# Altium schematic sheet Sensors.SchDoc
size A; SheetNumber: 4; SheetTotal: 7
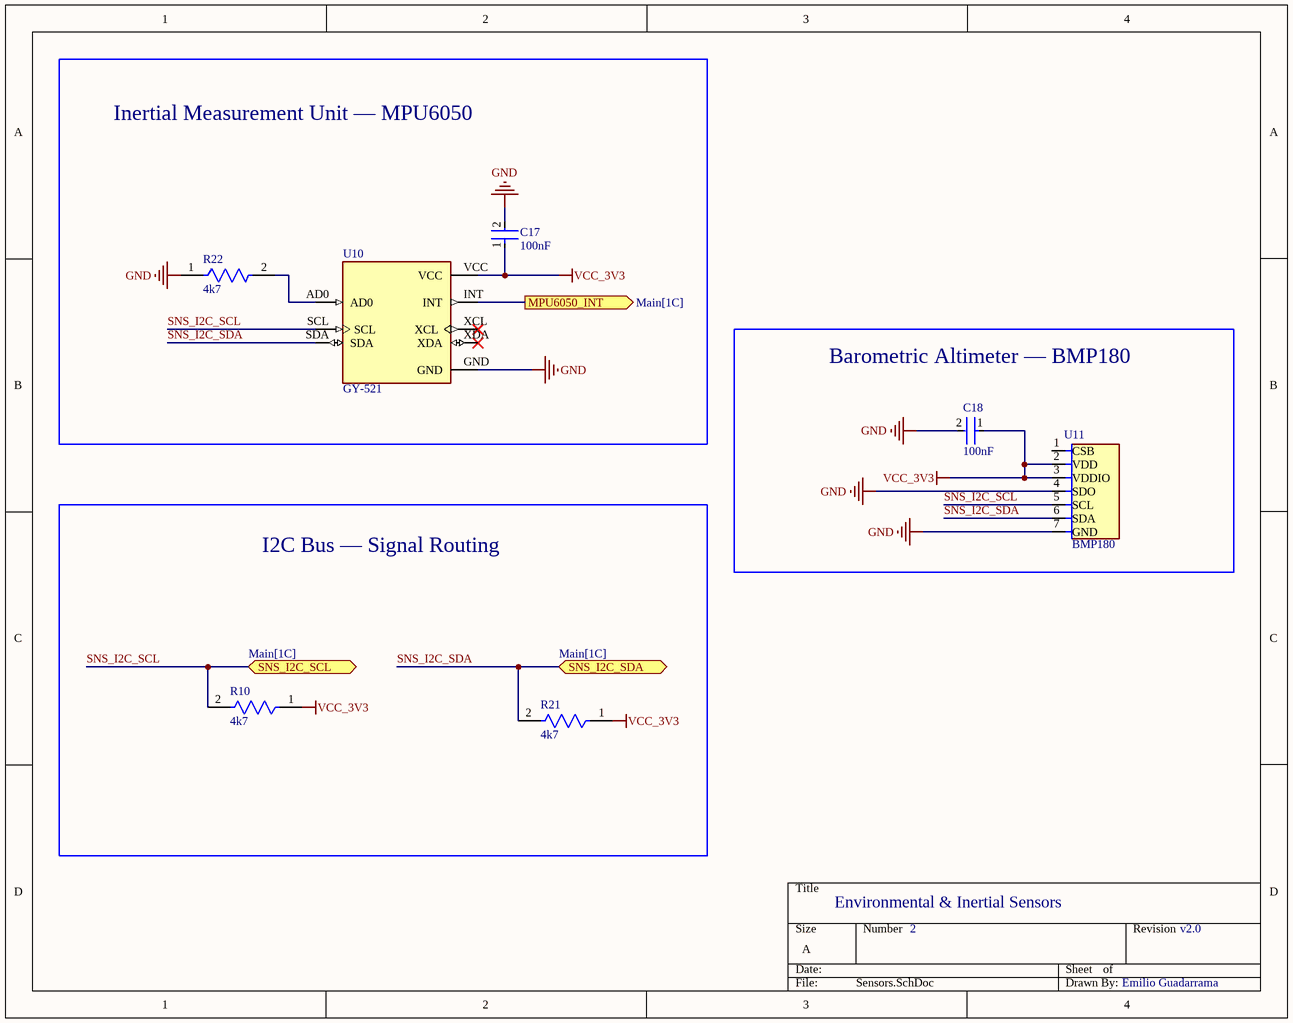
[diagram p0: Sensors.SchDoc]

## Parts
C17  100nF  [FP-C0805C-DN-MFG]
C18  100nF  [FP-C0805C-DN-MFG]
R10  4k7  [FP-MCT0603-IPC_A]
R21  4k7  [FP-MCT0603-IPC_A]
R22  4k7  [FP-MCT0603-IPC_A]
U10  GY-521  [MODULE_GY-521]
U11  BMP180  [LGA7-1.5-3.8X3.6MM]

## Blocks framed on the sheet
Inertial Measurement Unit — MPU6050: C17 R22 U10
I2C Bus — Signal Routing: R10 R21

## Ports
MPU6050_INT (out, see Main[1C]), SNS_I2C_SCL (bidir, see Main[1C]), SNS_I2C_SDA (bidir, see Main[1C])

## Nets
GND: C17.2 C18.2 R22.1 U10.GND U11.4(SDO) U11.7(GND)
VCC_3V3: C17.1 C18.1 R10.1 R21.1 U10.VCC U11.2(VDD) U11.3(VDDIO)
MPU6050_INT: U10.INT ; port MPU6050_INT
SNS_I2C_SCL: R10.2 U10.SCL U11.5(SCL) ; port SNS_I2C_SCL
SNS_I2C_SDA: R21.2 U10.SDA U11.6(SDA) ; port SNS_I2C_SDA
NetR22_2: R22.2 U10.AD0

Not connected (* = marked no-connect by the designer): U10 XCL* XDA*; U11 1(CSB)

## Notes on the sheet
- Barometric Altimeter — BMP180
- Environmental & Inertial Sensors
- 2
- v2.0
- Emilio Guadarrama

## Library data of the parts
C17 C18 = CMP-2007-00279-2: CAP CER 0.1UF 50V X7R 0805; Manufacturer Part Number: C0805C104K5RACTU; Manufacturer: KEMET; Value: 0.10 μF; Tolerance: 0.1; Temperature Coefficient: 30ppm/°C; Material: Ceramic; Device Class L2: Capacitors; Temperature Range Low: -55°C; Voltage Rating: 50 V; Digikey Description: CAP CER 0.1UF 50V X7R 0805; Category: Cap; ComponentLink2Description: Datasheet; Octopart: https://octopart.com/c0805c104k5ractu-kemet-143926; RoHS: TRUE; ComponentLink2URL: https://content.kemet.com/datasheets/KEM_C1003_C0G_SMD.pdf; Temperature Characteristic: X7R; Temperature: -55°C to +125°C; Height: 0.88mm; Temperature Range High: +125°C; Device Class L1: Passive Components; Automotive: No; Lead Free: Yes; Ipc Land Pattern Name: CAPC200125X78; Device Class L3: Ceramic Capacitors; Mouser Description: Cap Ceramic 0.1uF 50V X7R 10% SMD 2.0 x 1.2 mm 125 C Paper T/R; Capacitance: 0.10 μF; Package: C0805C-DN
R10 R21 R22 = CMP-02407-011165-1: RES SMD 100 OHM 1% 1/8W 0603; Temperature Coefficient: 25ppm/°C; Resistance: 20kR; Power Rating: 125mW; Tolerance: 0.1%; Voltage Rating: 75V; Length: 1.55mm; Case Code (Imperial): 0603; Case/Package: 0603; Construction: Rectangular; Package Quantity: 1000; Number of Terminations: 2; Termination: SMD/SMT; Resistor Type: Thin Film; Features: Automotive AEC-Q200; Series: MCT 0603 - Precision; Max Operating Temperature: 155°C; Depth: 0.85mm; Max Power Dissipation: 125mW; Min Operating Temperature: -55°C; Width: 0.033inch; Case Code (Metric): 1608; Packaging: Tape and Reel; Weight: 6.7E-05oz; Military Standard: Not; Height: 0.022inch
U10 = GY-521: Triple Axis Accelerometer Gyro Breakout; MF: GODREAM FORDREAM CO., LIMITED; SnapEDA_Link: https://www.snapeda.com/parts/GY-521/GODREAM+FORDREAM+CO.%252C+LIMITED/view-part/?ref=snap; Package: Package; Value: *; MP: GY-521; Check_prices: https://www.snapeda.com/parts/GY-521/GODREAM+FORDREAM+CO.%252C+LIMITED/view-part/?ref=eda
U11 = PRESSURE-BMP180(LGA7): Pressure Sensor 4.35PSI ~ 15.95PSI (30kPa ~ 110kPa) Absolute - 16 ~ 19 b 7-VLGA; MF: Bosch; SnapEDA_Link: https://www.snapeda.com/parts/BMP180/Bosch/view-part/?ref=snap; Package: LGA-7 Bosch; Value: *; MP: BMP180; Check_prices: https://www.snapeda.com/parts/BMP180/Bosch/view-part/?ref=eda